# Altium schematic sheet Main.SchDoc
size A4; SheetNumber: 1; SheetTotal: 5
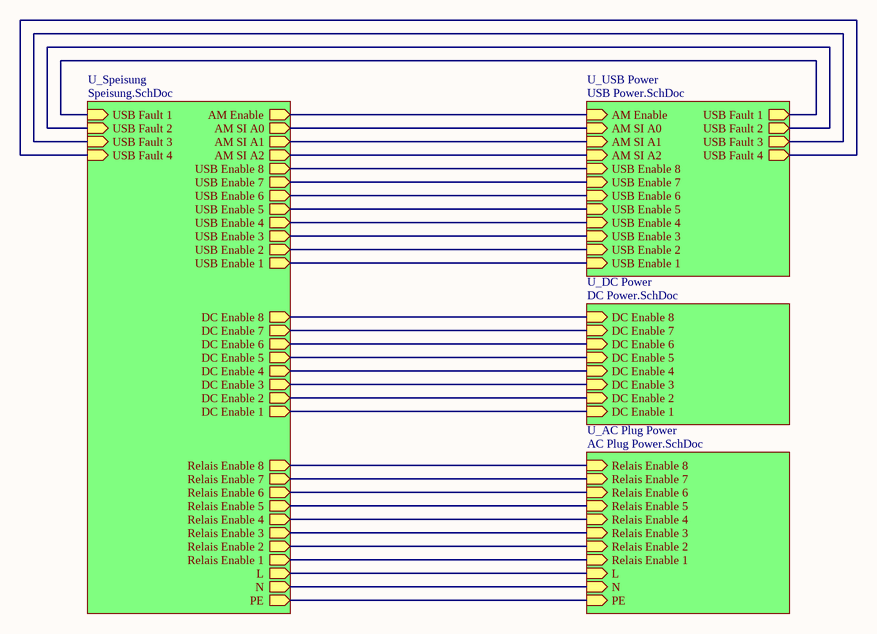
[diagram p0: Main.SchDoc]

## Sub-sheets
U_AC Plug Power = AC Plug Power.SchDoc: Relais Enable 1 (in), Relais Enable 2 (in), Relais Enable 4 (in), Relais Enable 6 (in), Relais Enable 8 (in), Relais Enable 7 (in), Relais Enable 5 (in), Relais Enable 3 (in), L (in), N (in), PE (in)
U_DC Power = DC Power.SchDoc: DC Enable 5 (in), DC Enable 1 (in), DC Enable 2 (in), DC Enable 3 (in), DC Enable 4 (in), DC Enable 6 (in), DC Enable 7 (in), DC Enable 8 (in)
U_Speisung = Speisung.SchDoc: N (out), L (out), PE (out), DC Enable 8 (out), DC Enable 7 (out), DC Enable 6 (out), DC Enable 5 (out), DC Enable 4 (out), DC Enable 3 (out), DC Enable 2 (out), DC Enable 1 (out), Relais Enable 8 (out), Relais Enable 7 (out), Relais Enable 6 (out), Relais Enable 5 (out), Relais Enable 4 (out), Relais Enable 3 (out), Relais Enable 2 (out), Relais Enable 1 (out), USB Enable 8 (out), USB Enable 7 (out), USB Enable 6 (out), USB Enable 5 (out), USB Enable 4 (out), USB Enable 3 (out), USB Enable 2 (out), USB Enable 1 (out), USB Fault 4 (in), USB Fault 3 (in), USB Fault 2 (in), USB Fault 1 (in), AM SI A2 (out), AM SI A1 (out), AM SI A0 (out), AM Enable (out)
U_USB Power = USB Power.SchDoc: AM SI A0 (in), AM SI A1 (in), AM SI A2 (in), AM Enable (in), USB Fault 1 (out), USB Fault 3 (out), USB Fault 2 (out), USB Fault 4 (out), USB Enable 7 (in), USB Enable 3 (in), USB Enable 1 (in), USB Enable 8 (in), USB Enable 4 (in), USB Enable 2 (in), USB Enable 6 (in), USB Enable 5 (in)

## Nets
(unnamed): sheet U_Speisung/N, sheet U_AC Plug Power/N
(unnamed): sheet U_Speisung/L, sheet U_AC Plug Power/L
(unnamed): sheet U_Speisung/PE, sheet U_AC Plug Power/PE
(unnamed): sheet U_Speisung/DC Enable 8, sheet U_DC Power/DC Enable 8
(unnamed): sheet U_Speisung/DC Enable 7, sheet U_DC Power/DC Enable 7
(unnamed): sheet U_Speisung/DC Enable 6, sheet U_DC Power/DC Enable 6
(unnamed): sheet U_Speisung/DC Enable 5, sheet U_DC Power/DC Enable 5
(unnamed): sheet U_Speisung/DC Enable 4, sheet U_DC Power/DC Enable 4
(unnamed): sheet U_Speisung/DC Enable 3, sheet U_DC Power/DC Enable 3
(unnamed): sheet U_Speisung/DC Enable 2, sheet U_DC Power/DC Enable 2
(unnamed): sheet U_Speisung/DC Enable 1, sheet U_DC Power/DC Enable 1
(unnamed): sheet U_Speisung/Relais Enable 8, sheet U_AC Plug Power/Relais Enable 8
(unnamed): sheet U_Speisung/Relais Enable 7, sheet U_AC Plug Power/Relais Enable 7
(unnamed): sheet U_Speisung/Relais Enable 6, sheet U_AC Plug Power/Relais Enable 6
(unnamed): sheet U_Speisung/Relais Enable 5, sheet U_AC Plug Power/Relais Enable 5
(unnamed): sheet U_Speisung/Relais Enable 4, sheet U_AC Plug Power/Relais Enable 4
(unnamed): sheet U_Speisung/Relais Enable 3, sheet U_AC Plug Power/Relais Enable 3
(unnamed): sheet U_Speisung/Relais Enable 2, sheet U_AC Plug Power/Relais Enable 2
(unnamed): sheet U_Speisung/Relais Enable 1, sheet U_AC Plug Power/Relais Enable 1
(unnamed): sheet U_Speisung/USB Enable 8, sheet U_USB Power/USB Enable 8
(unnamed): sheet U_Speisung/USB Enable 7, sheet U_USB Power/USB Enable 7
(unnamed): sheet U_Speisung/USB Enable 6, sheet U_USB Power/USB Enable 6
(unnamed): sheet U_Speisung/USB Enable 5, sheet U_USB Power/USB Enable 5
(unnamed): sheet U_Speisung/USB Enable 4, sheet U_USB Power/USB Enable 4
(unnamed): sheet U_Speisung/USB Enable 3, sheet U_USB Power/USB Enable 3
(unnamed): sheet U_Speisung/USB Enable 2, sheet U_USB Power/USB Enable 2
(unnamed): sheet U_Speisung/USB Enable 1, sheet U_USB Power/USB Enable 1
(unnamed): sheet U_Speisung/USB Fault 4, sheet U_USB Power/USB Fault 4
(unnamed): sheet U_Speisung/USB Fault 3, sheet U_USB Power/USB Fault 3
(unnamed): sheet U_Speisung/USB Fault 2, sheet U_USB Power/USB Fault 2
(unnamed): sheet U_Speisung/USB Fault 1, sheet U_USB Power/USB Fault 1
(unnamed): sheet U_Speisung/AM SI A2, sheet U_USB Power/AM SI A2
(unnamed): sheet U_Speisung/AM SI A1, sheet U_USB Power/AM SI A1
(unnamed): sheet U_Speisung/AM SI A0, sheet U_USB Power/AM SI A0
(unnamed): sheet U_Speisung/AM Enable, sheet U_USB Power/AM Enable

## Notes on the sheet
- Bahnhöheweg 70
- ICT Berufsbildungscenter AG
- Bereich Elektronik
- Datum:
- Version:
- Blattgrösse:
- Blattnummer:
- A4
- /
- 3018 Bern
- Dateiname: